# EAGLE design Battery Shield (EAGLE 6.5.0)
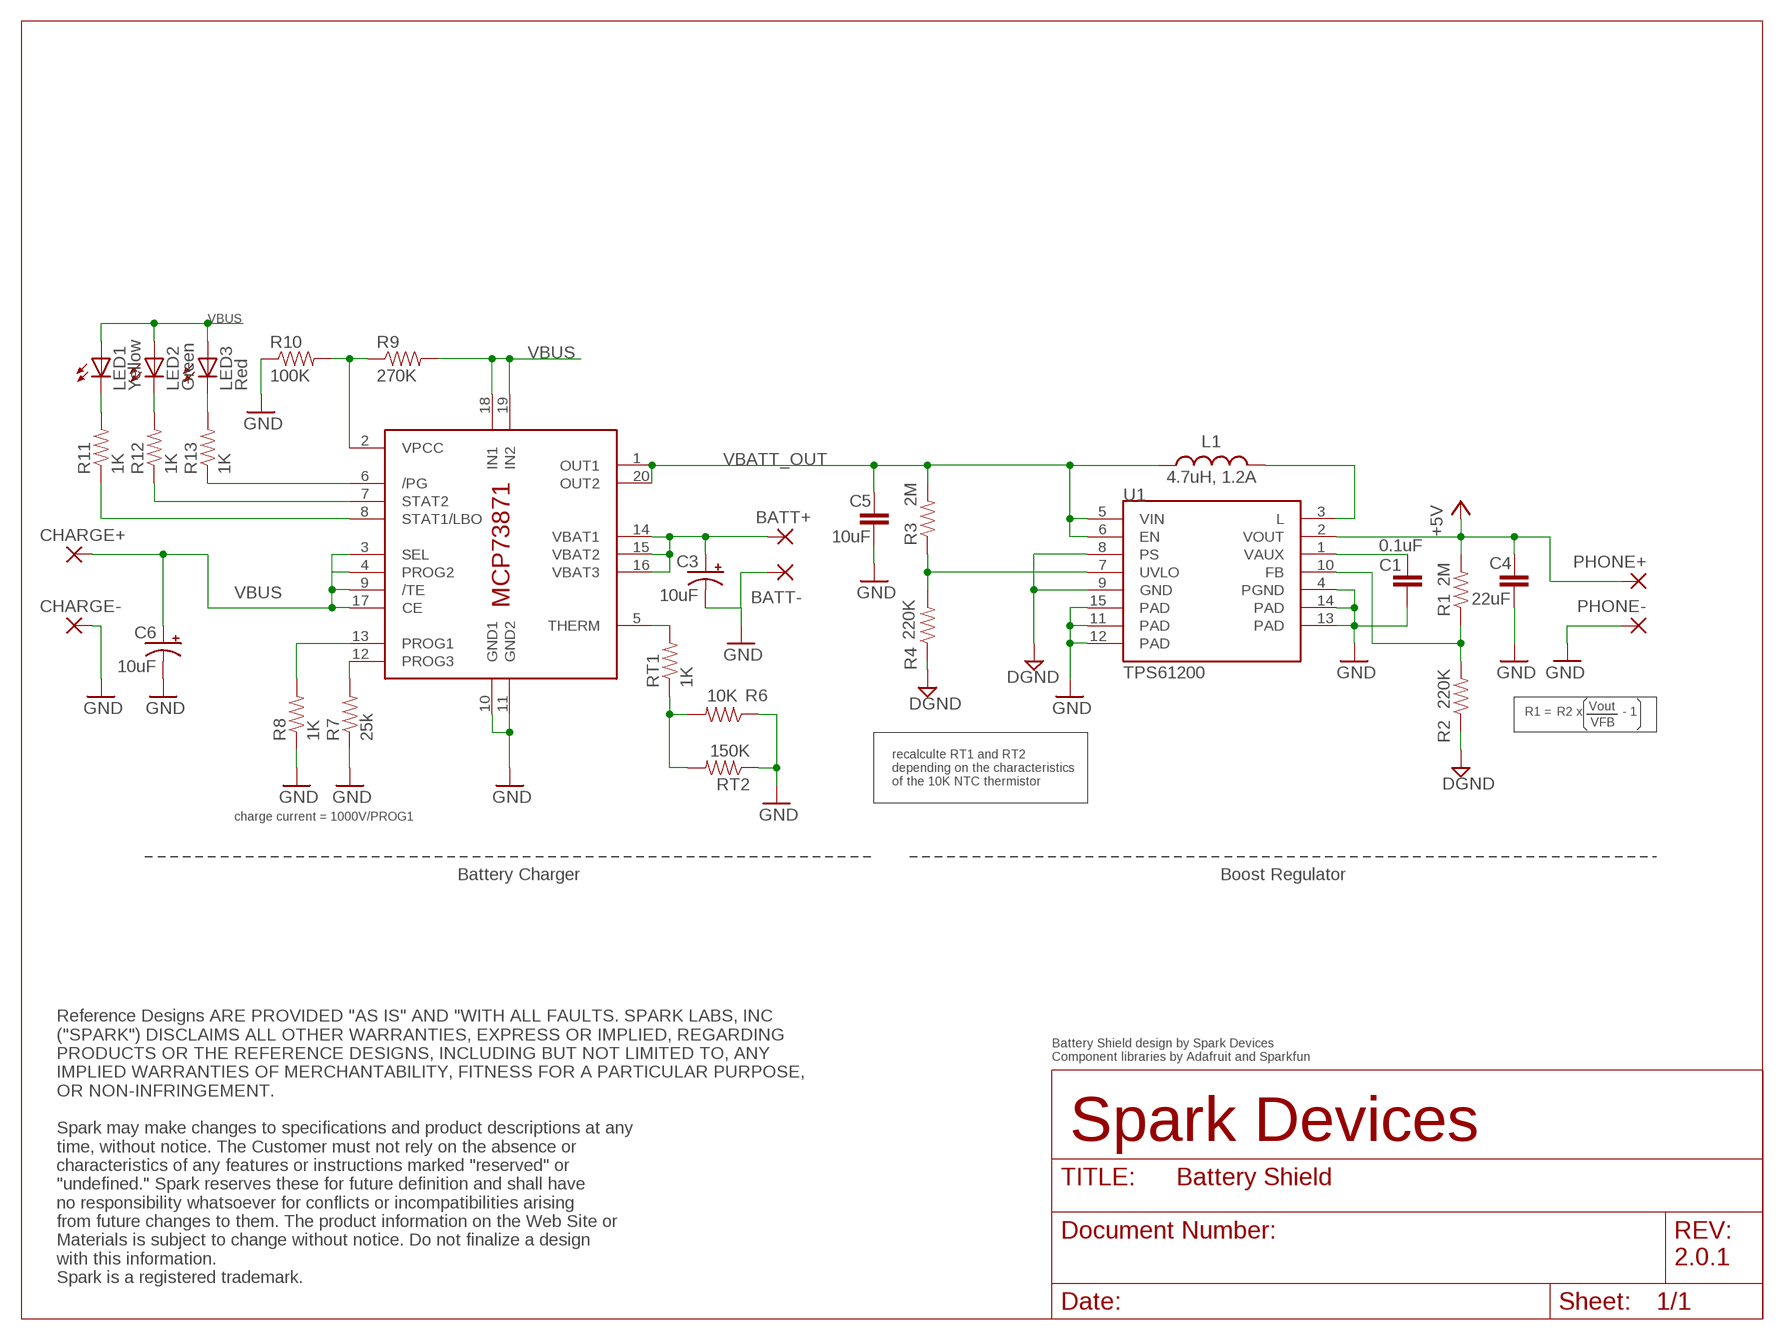
[diagram p0: schematic, sheet 1]

## Parts
BATT+  WIREPAD2,15/1,0  [2,15/1,0]
BATT-  WIREPAD2,15/1,0  [2,15/1,0]
C1  0.1uF  CAP0402-CAP  [0402-CAP]
C3  10uF  10UF-16V-10%(TANT)  [EIA3216]
C4  22uF  CAP0805  [0805]
C5  10uF  CAP1206  [1206]
C6  10uF  10UF-16V-10%(TANT)  [EIA3216]
CHARGE+  WIREPAD2,15/1,0  [2,15/1,0]
CHARGE-  WIREPAD2,15/1,0  [2,15/1,0]
IC1  MCP73871  [QFN20]
L1  4.7uH, 1.2A  INDUCTOR.  [CDRH2D09]
LED1  Yellow  LED0603  [LED-0603]
LED2  Green  LED0603  [LED-0603]
LED3  Red  LED0603  [LED-0603]
PHONE+  WIREPAD2,15/1,0  [2,15/1,0]
PHONE-  WIREPAD2,15/1,0  [2,15/1,0]
R1  2M  RESISTOR0402-RES  [0402-RES]
R2  220K  RESISTOR0402-RES  [0402-RES]
R3  2M  RESISTOR0402-RES  [0402-RES]
R4  220K  RESISTOR0402-RES  [0402-RES]
R6  10K  RESISTOR0402-RES  [0402-RES]
R7  25k  RESISTOR0402-RES  [0402-RES]
R8  1K  RESISTOR0402-RES  [0402-RES]
R9  270K  RESISTOR0402-RES  [0402-RES]
R10  100K  RESISTOR0402-RES  [0402-RES]
R11  1K  RESISTOR0402-RES  [0402-RES]
R12  1K  RESISTOR0402-RES  [0402-RES]
R13  1K  RESISTOR0402-RES  [0402-RES]
RT1  1K  RESISTOR0402-RES  [0402-RES]
RT2  150K  RESISTOR0402-RES  [0402-RES]
U1  TPS61200  [QFN-10_PAD]

## Nets
+5V: C4.1 PHONE+.1(P) R1.2 U1.2(VOUT)
DGND: R2.1 R4.1 U1.8(PS) U1.9(GND)
GND: BATT-.1(P) C1.2 C3.C(-) C4.2 C5.2 C6.C(-) CHARGE-.1(P) IC1.10(GND1) IC1.11(GND2) PHONE-.1(P) R6.1 R7.1 R8.1 R10.1 RT2.1 U1.4(PGND) U1.11(PAD) U1.12(PAD) U1.13(PAD) U1.14(PAD) U1.15(PAD)
N$1: L1.P$2 U1.3(L)
N$2: C1.1 U1.1(VAUX)
N$3: R3.1 R4.2 U1.7(UVLO)
N$4: R1.1 R2.2 U1.10(FB)
N$5: BATT+.1(P) C3.A(+) IC1.14(VBAT1) IC1.15(VBAT2) IC1.16(VBAT3)
N$6: IC1.8(STAT1/LBO) R11.1
N$7: R6.2 RT1.1 RT2.2
N$8: LED1.C R11.2
N$9: IC1.5(THERM) RT1.2
N$10: LED2.C R12.2
N$11: IC1.12(PROG3) R7.2
N$12: IC1.2(VPCC) R9.1 R10.2
N$13: IC1.13(PROG1) R8.2
N$14: IC1.7(STAT2) R12.1
N$15: IC1.6(/PG) R13.1
N$16: LED3.C R13.2
VBATT_OUT: C5.1 IC1.1(OUT1) IC1.20(OUT2) L1.P$1 R3.2 U1.5(VIN) U1.6(EN)
VBUS: C6.A(+) CHARGE+.1(P) IC1.3(SEL) IC1.4(PROG2) IC1.9(/TE) IC1.17(CE) IC1.18(IN1) IC1.19(IN2) LED1.A LED2.A LED3.A R9.2

## Notes on the sheet
- Vout
- R1 = | R2 | x | - 1
- VFB
- recalculte RT1 and RT2
  depending on the characteristics
  of the 10K NTC thermistor
- charge current = 1000V/PROG1
- Battery Charger | Boost Regulator
- Battery Shield design by Spark Devices
  Component libraries by Adafruit and Sparkfun
- Spark Devices
- 2.0.1
- Reference Designs ARE PROVIDED "AS IS" AND "WITH ALL FAULTS. SPARK LABS, INC 
  ("SPARK") DISCLAIMS ALL OTHER WARRANTIES, EXPRESS OR IMPLIED, REGARDING 
  PRODUCTS OR THE REFERENCE DESIGNS, INCLUDING BUT NOT LIMITED TO, ANY 
  IMPLIED WARRANTIES OF MERCHANTABILITY, FITNESS FOR A PARTICULAR PURPOSE,
  OR NON-INFRINGEMENT.
  
  Spark may make changes to specifications and product descriptions at any 
  time, without notice. The Customer must not rely on the absence or 
  characteristics of any features or instructions marked "reserved" or 
  "undefined." Spark reserves these for future definition and shall have 
  no responsibility whatsoever for conflicts or incompatibilities arising 
  from future changes to them. The product information on the Web Site or 
  Materials is subject to change without notice. Do not finalize a design 
  with this information. 
  Spark is a registered trademark.

## Library data of the parts
BATT+ BATT- CHARGE+ CHARGE- PHONE+ PHONE- = wirepad:WIREPAD: Wire PAD connect wire on PCB
C1 C4 = SparkFun-Passives:CAP: Capacitor Standard 0603 ceramic capacitor, and 0.1" leaded capacitor.
C3 C6 = SparkFun-Capacitors:10UF-16V-10%(TANT): CAP-00811 1206/EIA-3216 Tantalum capacitor; PROD_ID: CAP-00811
C5 = SparkFun-Capacitors:CAP: Capacitor Standard 0603 ceramic capacitor, and 0.1" leaded capacitor.
IC1 = adafruit:MCP73871
L1 = SparkFun-Passives:INDUCTOR: Inductors Basic Inductor/Choke - 0603 and 1206. Footprints are not proven and vary greatly between part numbers. SRN6045- 33uH, 20% 1.4A
LED1-LED3 = SparkFun-LED:LED: LEDs Standard schematic elements and footprints for 5mm, 3mm, 1206, and 0603 sized LEDs. 5mm - Spark Fun Electronics SKU : COM-00529 (and others)
R1-R4 R6-R13 RT1 RT2 = SparkFun-Passives:RESISTOR: Resistor Basic schematic elements and footprints for 0603, 1206, and PTH resistors.
U1 = SparkFun-PowerIC:TPS61200: DC to DC Booster IC-10035; PROD_ID: IC-10035

## Board
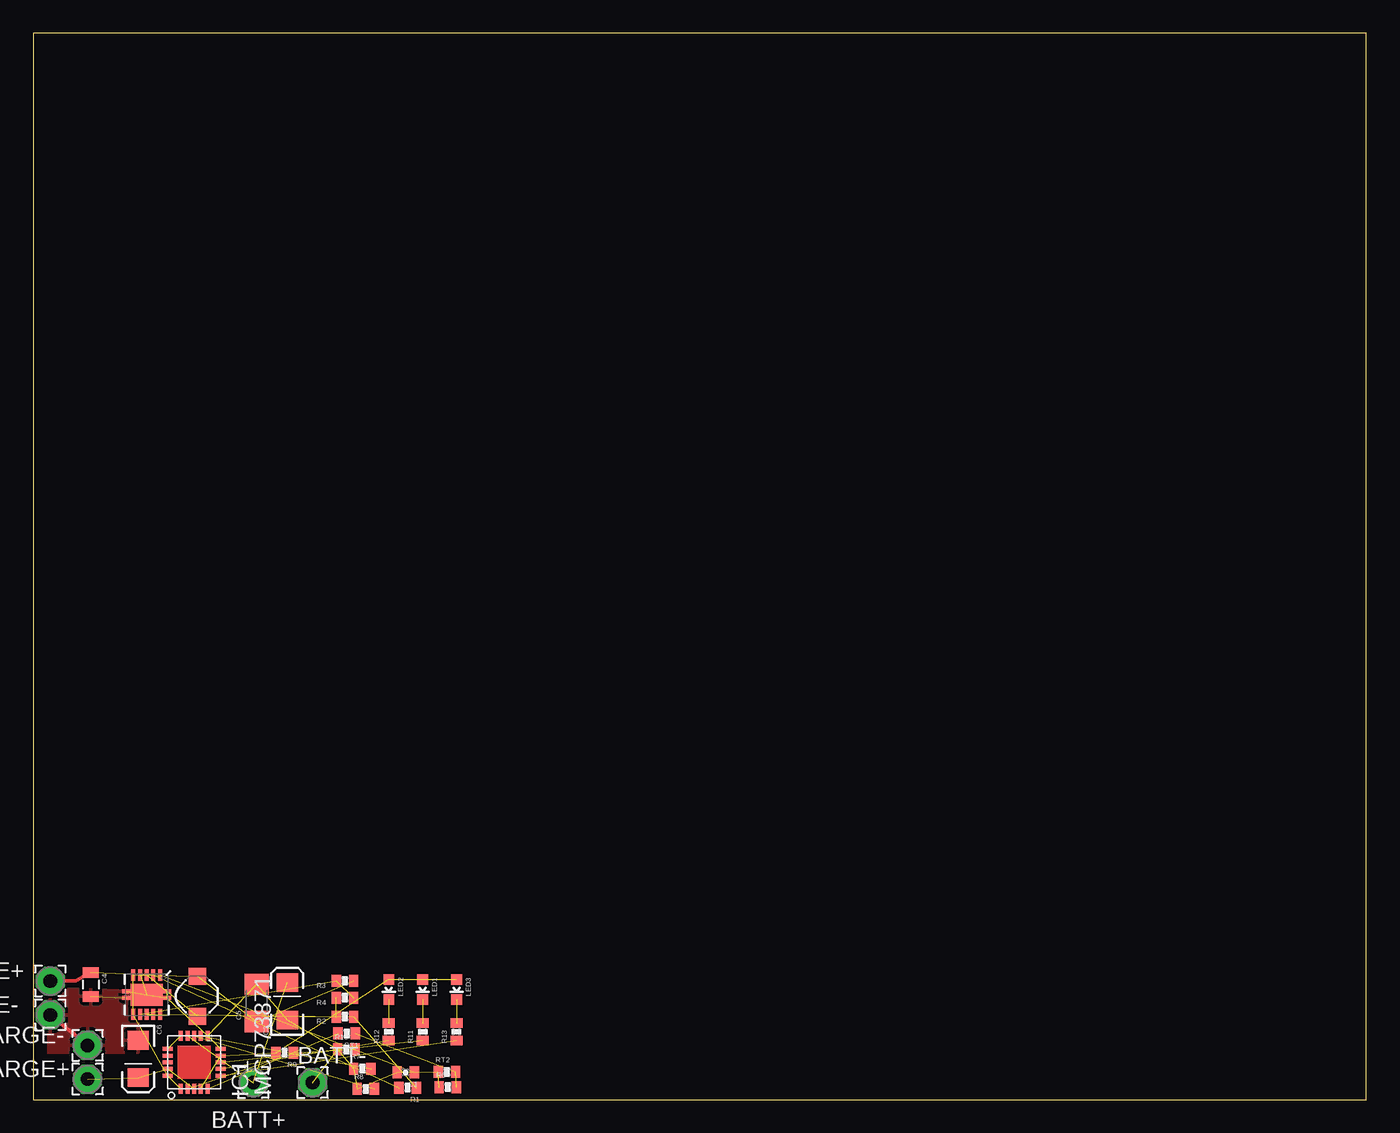
[diagram p1: board, top side]
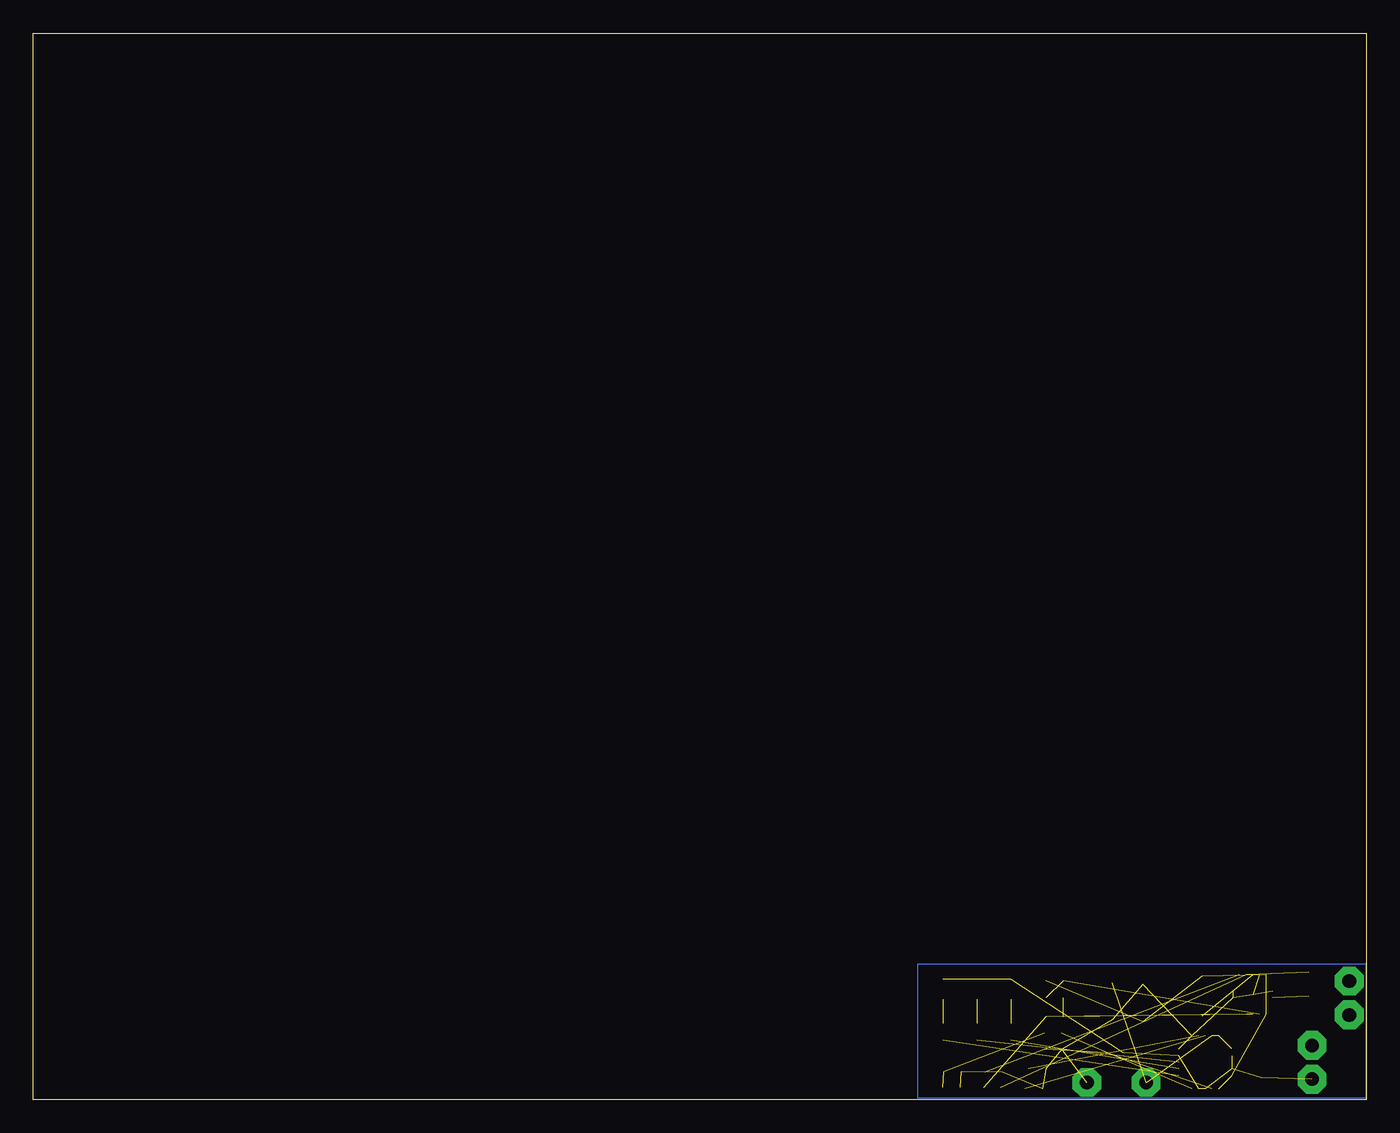
[diagram p2: board, bottom side, seen from below]

Size 100 x 80 mm. Coordinates in mm from the lower left corner, seen from the top.
Outline: 0,0 100,0 100,80 0,80 0,0
Copper layers (1*16): Top 0.035mm / dielectric 1.5mm / Bottom 0.035mm
Design rules "default": minimum track width 10mil, minimum drill 24mil, track to track 8mil, track to pad 8mil, pad to pad 8mil, via to via 8mil, smd to smd 8mil, copper to edge 40mil, drill to drill 8mil, minimum pad ring 10mil, minimum via ring 8mil, stop-mask expansion 4mil, vias tented up to drill 0mil, thermal gap 10mil

### Footprints (pad centres in the part's own frame; a part is rotated, then mirrored left to right if it is on the bottom)
2,15/1,0 = drill 1.016 pad 2.159 octagon: 1 0,0
0402-CAP = smd 0.7 x 0.9: 1 -0.65,0; 2 0.65,0
EIA3216 = smd 1.4 x 1.6: A 1.4,0; C -1.4,0
0805 = smd 0.8 x 1.2: 1 -0.9,0; 2 0.9,0
1206 = smd 1.6 x 1.8: 1 -1.4,0; 2 1.4,0
QFN20 = smd 0.75 x 0.3: 1 -2,1; 2 -2,0.5; 3 -2,0; 4 -2,-0.5; 5 -2,-1; 11 2,-1; 12 2,-0.5; 13 2,0; 14 2,0.5; 15 2,1 | smd 0.3 x 0.75: 6 -1,-2; 7 -0.5,-2; 8 0,-2; 9 0.5,-2; 10 1,-2; 16 1,2; 17 0.5,2; 18 0,2; 19 -0.5,2; 20 -1,2
CDRH2D09 = smd 1.3 x 1.3: P$1 -1.5,0; P$2 1.5,0
LED-0603 = smd 0.8 x 0.8: A 0,-0.75; C 0,0.75
0402-RES = smd 0.7 x 0.9: 1 -0.65,0; 2 0.65,0
QFN-10_PAD = smd 0.297 x 0.85: 1 -1,-1.475; 2 -0.5,-1.475; 3 0,-1.475; 4 0.5,-1.475; 5 1,-1.475; 6 1,1.475; 7 0.5,1.475; 8 0,1.475; 9 -0.5,1.475; 10 -1,1.475 | smd 0.7 x 0.28: 11 -1.5,0.25; 12 -1.5,-0.25; 13 1.5,0.25; 14 1.5,-0.25 | smd 2.4 x 1.65: 15 0,0

### Placement (x,y rotation side)
BATT+  16.51,1.27 0 top
BATT-  20.95,1.27 0 top
C1  27.94,2.03 180 top
C3  19.05,7.37 90 top
C4  4.32,8.64 270 top
C5  16.76,7.24 90 top
C6  7.87,3.05 270 top
CHARGE+  4.06,1.52 0 top
CHARGE-  4.06,4.06 0 top
IC1  12.06,2.79 90 top
L1  12.32,7.75 270 top
LED1  29.21,8.26 180 top
LED2  26.67,8.26 180 top
LED3  31.75,8.26 180 top
PHONE+  1.27,8.89 0 top
PHONE-  1.27,6.35 0 top
R1  28.08,0.89 180 top
R2  23.38,6.22 359.9 top
R3  23.38,8.91 0 top
R4  23.38,7.64 0 top
R6  31.1,0.92 0 top
R7  24.68,2.32 0 top
R8  24.94,0.8 0 top
R9  18.86,3.51 180 top
R10  23.48,3.76 0 top
R11  29.21,5.08 90 top
R12  26.67,5.08 90 top
R13  31.75,5.08 90 top
RT1  23.51,4.95 180 top
RT2  31.04,2.06 0 top
U1  8.51,7.87 180 top

### Tracks (layer width: path | path; a pad name or v marks a point on that pad's centre or on a via)
+5V  (2 unrouted)
  Top 0.254: PHONE+.1 3.19,8.89 C4.1
DGND  (3 unrouted)
GND  (16 unrouted)
  Top 0.305: PHONE-.1 CHARGE-.1
  pour Top: 7.87,3.56 7.87,7.87 7.62,8.13 0.25,8.38 0.25,3.56
N$1  (1 unrouted)
N$2  (1 unrouted)
N$3  (2 unrouted)
N$4  (2 unrouted)
N$5  (4 unrouted)
N$6  (1 unrouted)
N$7  (2 unrouted)
N$8  (1 unrouted)
N$9  (1 unrouted)
N$10  (1 unrouted)
N$11  (1 unrouted)
N$12  (2 unrouted)
N$13  (1 unrouted)
N$14  (1 unrouted)
N$15  (1 unrouted)
N$16  (1 unrouted)
N$17
  Bottom 0: 0,0.13 0,10.16 33.66,10.16 33.66,0.13 0,0.13
VBATT_OUT  (6 unrouted)
VBUS  (11 unrouted)